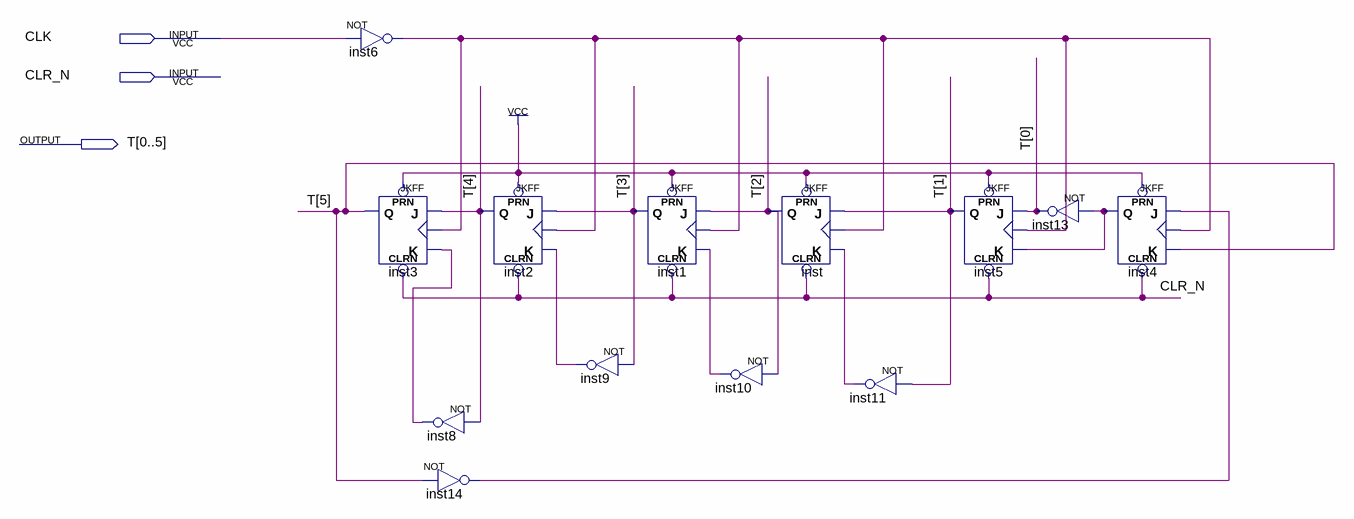
[diagram p0: schematic sheet]
// Quartus schematic RING_COUNTER.bdf as structural Verilog: 13 symbols, 3 pins
module RING_COUNTER (
  input  CLK,
  input  CLR_N,
  output [0:5] T
);

  wire inst4_q, inst6_out, inst8_out, inst9_out, inst10_out, inst11_out, inst14_out;

  not inst6 (inst6_out, CLK);
  JKFF inst3 (.PRN(1'b1), .CLRN(CLR_N), .K(inst8_out), .J(T[4]), .CLK(inst6_out), .Q(T[5]));
  JKFF inst2 (.PRN(1'b1), .CLRN(CLR_N), .K(inst9_out), .J(T[3]), .CLK(inst6_out), .Q(T[4]));
  not inst8 (inst8_out, T[4]);
  not inst14 (inst14_out, T[5]);
  JKFF inst1 (.PRN(1'b1), .CLRN(CLR_N), .K(inst10_out), .J(T[2]), .CLK(inst6_out), .Q(T[3]));
  not inst9 (inst9_out, T[3]);
  JKFF inst (.PRN(1'b1), .CLRN(CLR_N), .K(inst11_out), .J(T[1]), .CLK(inst6_out), .Q(T[2]));
  not inst10 (inst10_out, T[2]);
  not inst11 (inst11_out, T[1]);
  JKFF inst5 (.PRN(1'b1), .CLRN(CLR_N), .K(inst4_q), .J(T[0]), .CLK(inst6_out), .Q(T[1]));
  not inst13 (T[0], inst4_q);
  JKFF inst4 (.PRN(1'b1), .CLRN(CLR_N), .K(T[5]), .J(inst14_out), .CLK(inst6_out), .Q(inst4_q));
endmodule
